# EAGLE board HandCream2040 (EAGLE 9.6.2)
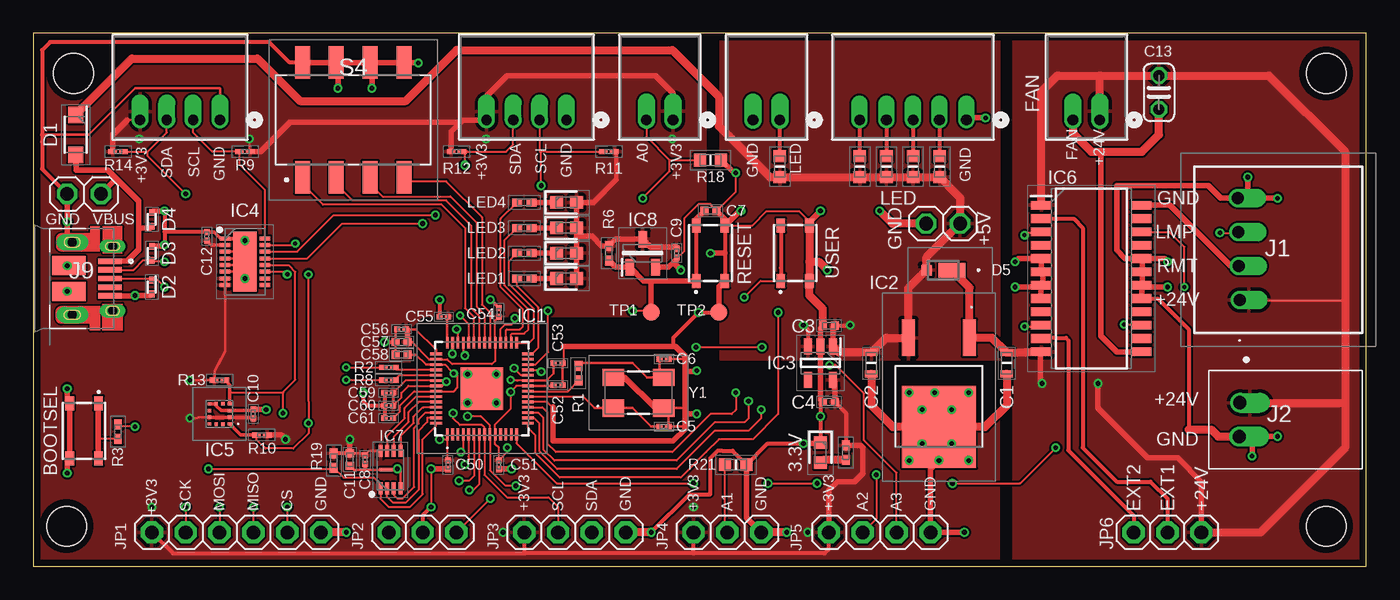
[diagram p1: board, top side]
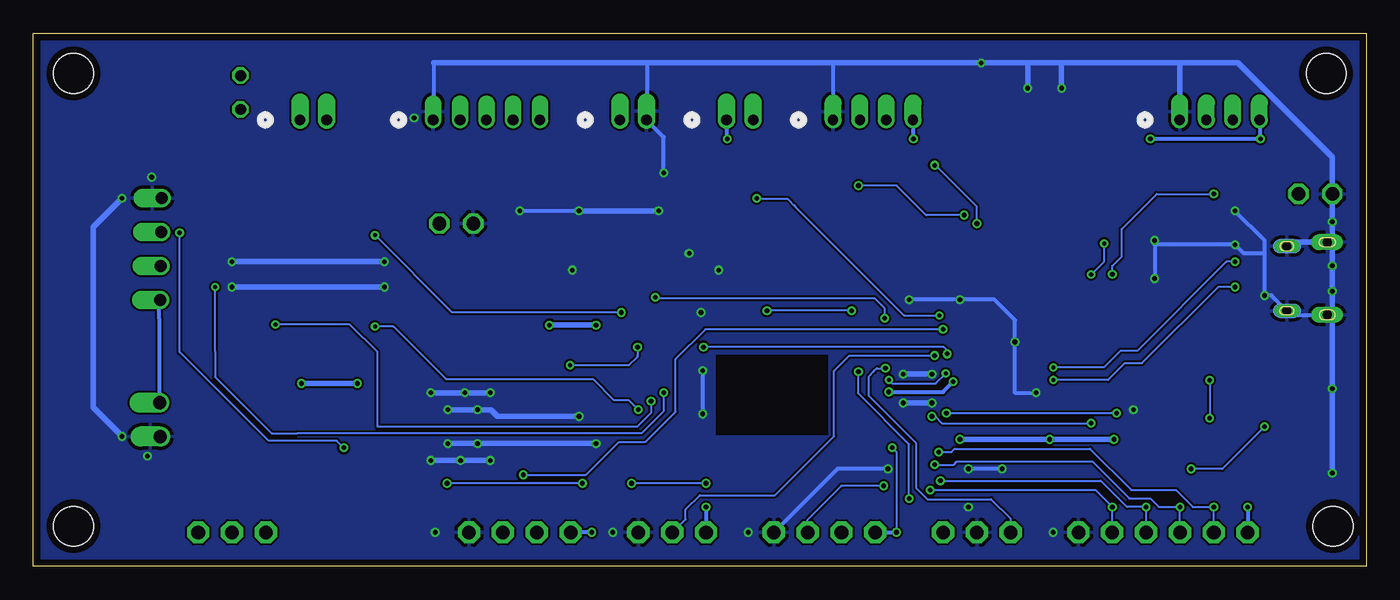
[diagram p2: board, bottom side, seen from below]

Size 100 x 40 mm. Coordinates in mm from the lower left corner, seen from the top.
Outline: 0,0 100,0 100,40 0,40 0,0
Copper layers (1*16): Top 0.035mm / dielectric 1.6mm / Bottom 0.035mm
Design rules "Elecrow_2-layer_PCB_eagle_rule": minimum track width 6mil, minimum drill 12mil, track to track 6mil, track to pad 6mil, pad to pad 6mil, via to via 8mil, smd to smd 0mil, copper to edge 20mil, drill to drill 10mil, minimum pad ring 6mil, minimum via ring 6mil, stop-mask expansion 0mil, vias tented up to drill 100mil, thermal gap 10mil
Net classes: 1 power: width 0.152 mm, drill 0.152 mm, clearance 0.152 mm; 2 gnd: width 0.152 mm, drill 0.152 mm, clearance 0.152 mm; 3 usbvcc: width 0.152 mm, drill 0.152 mm, clearance 0.152 mm
Holes 3 mm at 3,37 97,37 97,3 2.5,3
bRestrict: area 40.4,9.8 to 48.8,15.9

## Footprints (pad centres in the part's own frame; a part is rotated, then mirrored left to right if it is on the bottom)
CAPC1608X90N = smd 0.54 x 0.94: 1 -0.8,0; 2 0.8,0
CAPC1608X80N = smd 0.54 x 0.94: 1 -0.8,0; 2 0.8,0
CAPC1005X55N = smd 0.6 x 0.62: 1 -0.46,0; 2 0.46,0
CAPC0603X33N = smd 0.46 x 0.42: 1 -0.33,0; 2 0.33,0
C025-024X044 = drill 0.813 octagon: 1 -1.27,0; 2 1.27,0
SODFL3616X98N = smd 1.24 x 1.12: 1 -1.5,0; 2 1.5,0
SODFL1006X45N = smd 0.5 x 0.42: 1 -0.525,0; 2 0.525,0
VS1EQH01HM3H = smd 2 x 1.1: 1 -0.65,0 | smd 0.8 x 0.8: 2 1.25,0
SC091413 = smd 0.875 x 0.2: 1 -3.438,2.6; 2 -3.438,2.2; 3 -3.438,1.8; 4 -3.438,1.4; 5 -3.438,1; 6 -3.438,0.6; 7 -3.438,0.2; 8 -3.438,-0.2; 9 -3.438,-0.6; 10 -3.438,-1; 11 -3.438,-1.4; 12 -3.438,-1.8; 13 -3.438,-2.2; 14 -3.438,-2.6; 29 3.438,-2.6; 30 3.438,-2.2; 31 3.438,-1.8; 32 3.438,-1.4; 33 3.438,-1; 34 3.438,-0.6; 35 3.438,-0.2; 36 3.438,0.2; 37 3.438,0.6; 38 3.438,1; 39 3.438,1.4; 40 3.438,1.8; 41 3.438,2.2; 42 3.438,2.6 | smd 0.2 x 0.875: 15 -2.6,-3.438; 16 -2.2,-3.438; 17 -1.8,-3.438; 18 -1.4,-3.438; 19 -1,-3.438; 20 -0.6,-3.438; 21 -0.2,-3.438; 22 0.2,-3.438; 23 0.6,-3.438; 24 1,-3.438; 25 1.4,-3.438; 26 1.8,-3.438; 27 2.2,-3.438; 28 2.6,-3.438; 43 2.6,3.438; 44 2.2,3.438; 45 1.8,3.438; 46 1.4,3.438; 47 1,3.438; 48 0.6,3.438; 49 0.2,3.438; 50 -0.2,3.438; 51 -0.6,3.438; 52 -1,3.438; 53 -1.4,3.438; 54 -1.8,3.438; 55 -2.2,3.438; 56 -2.6,3.438 | smd 3.2 x 3.2: 57 0,0
TPS7A6533QKVURQ1 = smd 2.75 x 1: 1 0,2.29; 3 0,-2.29 | smd 6.15 x 5.55: 2 6.7,0
SOT95P280X145-5N = smd 1.2 x 0.6: 1 -1.25,0.95; 2 -1.25,0; 3 -1.25,-0.95; 4 1.25,-0.95; 5 1.25,0.95
SON50P300X500X80-17N = smd 0.8 x 0.3: 1 -1.5,1.75; 2 -1.5,1.25; 3 -1.5,0.75; 4 -1.5,0.25; 5 -1.5,-0.25; 6 -1.5,-0.75; 7 -1.5,-1.25; 8 -1.5,-1.75; 9 1.5,-1.75; 10 1.5,-1.25; 11 1.5,-0.75; 12 1.5,-0.25; 13 1.5,0.25; 14 1.5,0.75; 15 1.5,1.25; 16 1.5,1.75 | smd 1.75 x 4.5: 17 0,0
MC3479 = smd 0.275 x 0.25: 1 -0.762,0.75; 2 -0.762,0.25; 3 -0.762,-0.25; 4 -0.762,-0.75; 7 0.763,-0.75; 8 0.763,-0.25; 9 0.763,0.25; 10 0.763,0.75 | smd 0.25 x 0.275: 5 -0.25,-0.763; 6 0.25,-0.763; 11 0.25,0.762; 12 -0.25,0.762
SOP100P800X190-24N = smd 1.525 x 0.65: 1 -3.762,5.5; 2 -3.762,4.5; 3 -3.762,3.5; 4 -3.762,2.5; 5 -3.762,1.5; 6 -3.762,0.5; 7 -3.762,-0.5; 8 -3.762,-1.5; 9 -3.762,-2.5; 10 -3.762,-3.5; 11 -3.762,-4.5; 12 -3.762,-5.5; 13 3.762,-5.5; 14 3.762,-4.5; 15 3.762,-3.5; 16 3.762,-2.5; 17 3.762,-1.5; 18 3.762,-0.5; 19 3.762,0.5; 20 3.762,1.5; 21 3.762,2.5; 22 3.762,3.5; 23 3.762,4.5; 24 3.762,5.5
SON50P300X200X60-9N = smd 0.9 x 0.3: 1 -1.4,0.75; 2 -1.4,0.25; 3 -1.4,-0.25; 4 -1.4,-0.75; 5 1.4,-0.75; 6 1.4,-0.25; 7 1.4,0.25; 8 1.4,0.75 | smd 0.25 x 1.65: 9 0,0
SOT96P237X112-3N = smd 1.25 x 0.65: 1 -1.05,0.96; 2 -1.05,-0.96; 3 1.05,0
S04BXASS1NBNLFSN = drill 0.9 pad 1.4 offset: 1 0,0; 2 2.54,0.04; 3 5.08,0.08; 4 7.62,0.12
JST_S2B-XH-A(LF)(SN) = drill 1 offset: 1 -1.27,0.02; 2 1.27,-0.02
CONN_S4B-PH-K-S_JST = drill 0.762 pad 1.27 offset: 1 0,0; 2 2.007,0; 3 3.988,0; 4 5.994,0
CONN_S2B-PH-K-S_JST = drill 0.813 pad 1.321 offset: 1 0,0; 2 2.007,0
CONN_S5B-PH-K-S_JST = drill 0.813 offset: 1 0,0; 2 2.007,0; 3 3.988,0; 4 5.994,0; 5 8.001,0
AMPHENOL_10103594-0001LF = smd 0.4 x 1.75: 1 -1.3,2.825; 2 -0.65,2.825; 3 0,2.825; 4 0.65,2.825; 5 1.3,2.825 | drill 0.65 pad 0.73 long: 6 -2.425,3.03; 7 2.425,3.03 | drill 0.7 pad 1.2 long: 8 -2.725,0; 9 2.725,0 | smd 1.05 x 2.1 bottom: 10 -2.425,3.03; 11 2.425,3.03 | smd 1.425 x 2.5: S1 -0.963,-0.25; S2 0.963,-0.25
1X06 = drill 1.016 pad 1.676 octagon: 1 -6.35,0; 2 -3.81,0; 3 -1.27,0; 4 1.27,0; 5 3.81,0; 6 6.35,0
1X03 = drill 1.016 pad 1.676 octagon: 1 -2.54,0; 2 0,0; 3 2.54,0
1X04 = drill 1.016 pad 1.676 octagon: 1 -3.81,0; 2 -1.27,0; 3 1.27,0; 4 3.81,0
1X02 = drill 1.016 octagon: 1 -1.27,0; 2 1.27,0
LEDC1608X80N = smd 0.95 x 0.95: 1 -0.75,0; 2 0.75,0
RESC1005X35N = smd 0.75 x 0.6: 1 -0.55,0; 2 0.55,0
RESC0603X28N = smd 0.625 x 0.4: 1 -0.412,0; 2 0.412,0
RESC1608X55N = smd 0.9 x 0.95: 1 -0.8,0; 2 0.8,0
RESC1005X40N = smd 0.75 x 0.6: 1 -0.55,0; 2 0.55,0
SMT(4.2X3.2) = smd 1.05 x 0.65: 1 -2.075,1.075; 2 2.075,1.075; 3 -2.075,-1.075; 4 2.075,-1.075
2194MST = smd 1.13 x 2.44: 1 -3.81,-4.3; 2 -1.27,-4.3; 3 1.27,-4.3; 4 3.81,-4.3; 5 3.81,4.3; 6 1.27,4.3; 7 -1.27,4.3; 8 -3.81,4.3
B1,27 = smd 1.27 x 1.27: TP 0,0
ABM3BAIG = smd 1.6 x 1.3: 1 -1.9,-1.15; 2 1.9,-1.15; 3 1.9,1.15; 4 -1.9,1.15

## Placement (x,y rotation side)
C1  CGA3E3X5R1H334K080AB  [CAPC1608X90N]  73.03,15.24 90 top
C2  C1608X5R1H104K080AA  [CAPC1608X80N]  62.87,15.24 90 top
C3  GRM155R61E105KE11J  [CAPC1005X55N]  59.69,18.05 0 top
C4  GRM155R61E105KE11J  [CAPC1005X55N]  59.69,12.34 0 top
C5  GRM0335C1E150FA01D  [CAPC0603X33N]  47.31,10.48 0 top
C6  GRM0335C1E150FA01D  [CAPC0603X33N]  47.31,15.56 0 top
C7  GRM155R61E105KE11J  [CAPC1005X55N]  50.8,26.67 180 top
C8  GRM033R60J104KE19D  [CAPC0603X33N]  24.89,8 90 top
C9  GRM033R60J104KE19D  [CAPC0603X33N]  48.26,23.5 90 top
C10  GRM033R60J104KE19D  [CAPC0603X33N]  16.51,11.43 270 top
C11  GRM155R61A225KE01J  [CAPC1005X55N]  23.75,8 90 top
C12  GRM033R60J104KE19D  [CAPC0603X33N]  13.02,24.77 270 top
C13  [C025-024X044]  84.45,35.56 90 top
C50  GRM033R60J104KE19D  [CAPC0603X33N]  31.11,7.62 90 top
C51  GRM033R60J104KE19D  [CAPC0603X33N]  34.92,7.62 90 top
C52  GRM033R60J104KE19D  [CAPC0603X33N]  39.37,13.59 180 top
C53  GRM033R60J104KE19D  [CAPC0603X33N]  39.37,15.24 180 top
C54  GRM033R60J104KE19D  [CAPC0603X33N]  34.92,19.05 270 top
C55  GRM033R60J104KE19D  [CAPC0603X33N]  30.8,18.73 0 top
C56  GRM033R60J104KE19D  [CAPC0603X33N]  27.62,17.78 0 top
C57  GRM155R61A225KE01J  [CAPC1005X55N]  27.62,16.83 0 top
C58  GRM155R61A225KE01J  [CAPC1005X55N]  27.62,15.88 0 top
C59  GRM033R60J104KE19D  [CAPC0603X33N]  26.67,13.02 0 top
C60  GRM033R60J104KE19D  [CAPC0603X33N]  26.67,12.06 0 top
C61  GRM033R60J104KE19D  [CAPC0603X33N]  26.67,11.11 0 top
D1  MBR120VLSFT1G  [SODFL3616X98N]  3.17,32.38 270 top
D2  DF2S6.8FS,L3M  [SODFL1006X45N]  8.89,20.95 270 top
D3  DF2S6.8FS,L3M  [SODFL1006X45N]  8.89,23.5 90 top
D4  DF2S6.8FS,L3M  [SODFL1006X45N]  8.89,26.04 90 top
D5  VS-1EQH01HM3_H  [VS1EQH01HM3H]  68.26,22.23 180 top
IC1  SC0914_13_  [SC091413]  33.66,13.34 90 top
IC2  UA78M05CKVURG3  [TPS7A6533QKVURQ1]  67.94,17.14 270 top
IC3  MIC5504-3.3YM5-TR  [SOT95P280X145-5N]  59.05,15.24 270 top
IC4  LTC4317CDHC#PBF  [SON50P300X500X80-17N]  15.88,22.86 0 top
IC5  MC3479  [MC3479]  13.97,11.43 180 top
IC6  TBD62064AFAG,EL  [SOP100P800X190-24N]  79.38,21.59 0 top
IC7  W25Q16JVUXIQ_TR  [SON50P300X200X60-9N]  26.8,7.24 90 top
IC8  MCP111T-315E_TT  [SOT96P237X112-3N]  45.72,23.5 90 top
J1  S04B-XASS-1N-BN_LF__SN_  [S04BXASS1NBNLFSN]  90.5,20 90 top
J2  S2B-XH-A(LF)(SN)  [JST_S2B-XH-A(LF)(SN)]  90.5,11 270 top
J3  S4B-PH-K-S(LF)(SN)  [CONN_S4B-PH-K-S_JST]  14,33.5 180 top
J4  S4B-PH-K-S(LF)(SN)  [CONN_S4B-PH-K-S_JST]  40,33.5 180 top
J5  S2B-PH-K-S(LF)(SN)  [CONN_S2B-PH-K-S_JST]  48,33.5 180 top
J6  S2B-PH-K-S(LF)(SN)  [CONN_S2B-PH-K-S_JST]  56,33.5 180 top
J7  S5B-PH-K-S_(LF)(SN)  [CONN_S5B-PH-K-S_JST]  70,33.5 180 top
J8  S2B-PH-K-S(LF)(SN)  [CONN_S2B-PH-K-S_JST]  80,33.5 180 top
J9  10103594-0001LF  [AMPHENOL_10103594-0001LF]  2.92,21.59 270 top
JP1  [1X06]  15.24,2.54 0 top
JP2  [1X03]  29.21,2.54 0 top
JP3  [1X04]  40.64,2.54 0 top
JP4  [1X03]  52.07,2.54 0 top
JP5  [1X04]  63.5,2.54 0 top
JP6  [1X03]  85.09,2.54 180 top
JP7  [1X02]  3.81,27.94 180 top
JP8  [1X02]  68.26,25.72 180 top
LED1  150060VS75000  [LEDC1608X80N]  40.01,21.59 0 top
LED2  150060VS75000  [LEDC1608X80N]  40.01,23.5 0 top
LED3  150060VS75000  [LEDC1608X80N]  40.01,25.4 0 top
LED4  150060VS75000  [LEDC1608X80N]  40.01,27.3 0 top
LED5  150060VS75000  [LEDC1608X80N]  59.05,8.53 270 top
R1  CRCW04021K00FKEDC  [RESC1005X35N]  40.89,14.48 270 top
R2  CRCW020127R0FNED  [RESC0603X28N]  26.67,14.92 0 top
R3  CRCW04021K00FKEDC  [RESC1005X35N]  6.35,10.1 270 top
R4  CRCW060310K0FKECC  [RESC1608X55N]  62,30 90 top
R5  CRCW0402620RFKED  [RESC1005X40N]  60.96,8.53 90 top
R6  CRCW040210K0FKEDC  [RESC1005X35N]  43.18,23.5 90 top
R7  CRCW060310K0FKECC  [RESC1608X55N]  64,30 90 top
R8  CRCW020127R0FNED  [RESC0603X28N]  26.67,13.97 0 top
R9  CRCW02014K70FNED  [RESC0603X28N]  15.88,31.11 0 top
R10  CRCW02014K70FNED  [RESC0603X28N]  17.14,9.84 0 top
R11  CRCW02014K70FNED  [RESC0603X28N]  43.18,31.11 0 top
R12  CRCW02014K70FNED  [RESC0603X28N]  31.75,31.11 180 top
R13  CRCW02014K70FNED  [RESC0603X28N]  13.97,13.97 180 top
R14  CRCW02014K70FNED  [RESC0603X28N]  6.35,31.11 180 top
R15  CRCW060310K0FKECC  [RESC1608X55N]  66,30 90 top
R16  CRCW060310K0FKECC  [RESC1608X55N]  68,30 90 top
R17  CRCW060310K0FKECC  [RESC1608X55N]  56,30 90 top
R18  CRCW060310K0FKECC  [RESC1608X55N]  50.8,30.48 0 top
R19  CRCW040210K0FKEDC  [RESC1005X35N]  22.54,7.94 90 top
R21  CRCW060310K0FKECC  [RESC1608X55N]  52.7,7.62 0 top
R22  CRCW0402620RFKED  [RESC1005X40N]  36.83,27.3 180 top
R23  CRCW0402620RFKED  [RESC1005X40N]  36.83,25.4 180 top
R24  CRCW0402620RFKED  [RESC1005X40N]  36.83,23.5 180 top
R25  CRCW0402620RFKED  [RESC1005X40N]  36.83,21.59 180 top
S1  SKRPACE010  [SMT(4.2X3.2)]  3.81,10.16 270 top
S2  SKRPACE010  [SMT(4.2X3.2)]  50.8,23.5 90 top
S3  SKRPACE010  [SMT(4.2X3.2)]  57.15,23.5 90 top
S4  219-4MST  [2194MST]  24,33.5 0 top
TP1  TPB1,27  [B1,27]  46.35,19.05 0 top
TP2  TPB1,27  [B1,27]  51.44,19.05 0 top
Y1  ABM3BAIG-12.000MHZ-12-4-T  [ABM3BAIG]  45.4,13.02 0 top

## Tracks (layer width: path | path; a pad name or v marks a point on that pad's centre or on a via)
+1V1  (via drill 0.3)
  Top 0.152: C61.2 27.46,11.58 27.46,12.02 28.58,13.13 IC1.50 31.55,13.13 31.83,13.41 31.83,14.35 31.57,14.61 31.42,14.61 | IC1.45 30.89,15.13 31.39,14.63 | 31.39,14.63 31.42,14.61 | IC1.23 36.36,13.94 36.27,13.94 35.85,13.94 v35.82,13.97 35.81,14.02 v35.81,13.97 | 38.57,14.01 38.56,14.02 38.53,13.94 | v31.55,14.48 31.39,14.48 31.39,14.63 | 31.39,14.63 31.42,14.61
  Top 0.203: IC1.45 29.46,15.13 28.72,15.88 C58.2 | IC1.23 38.53,13.94 | C53.2 39.04,14.48 38.57,14.01
  Bottom 0.152: v35.81,13.97 35.56,13.72 32.31,13.72 v31.55,14.48
+3V3  (via drill 0.35)
  Top 0.152: J3.4 7.05,33.5 | C51.2 34.87,7.95 | 28.05,17.78 C56.2 | IC1.1 31.05,9.53 | 31.05,9.53 31.05,8.01 C50.2 | IC1.49 28.14,13.54 27.62,13.02 27.62,12.69 C60.2 C59.2 27.92,13.94 IC1.48 | 31.05,18.66 C55.2 | R11.2 43.73,30.98 | 32.24,33.5 32.08,33.34 | JP3.1 36.83,0.95 | R9.2 16.19,31.11 v16.19,32.07 | C51.2 34.92,8.89 34.66,9.16 IC1.10 34.66,10.65 35.81,11.81 v35.81,13.08 36.25,13.52 36.25,13.54 IC1.22 | C54.2 34.66,18.45 IC1.33 34.66,15.4 34.42,15.16 31.42,15.16 31.05,15.54 IC1.44 | v11.75,13.97 R13.2 | 13.97,11.18 12.38,11.18 12.31,11.11 v11.75,11.11 | 38.99,13.54 C52.2 | v30.48,9.53 31.05,9.53 | C11.2 23.72,8.49 | C51.2 35.56,8.59 v35.56,8.89
  Top 0.203: IC1.44 29.69,15.54 28.4,16.83 C57.2 | IC1.43 30.22,16.25 28.69,17.78 28.05,17.78 | IC1.22 38.64,13.54 38.99,13.54 | C11.2 24.76,8.46 C8.2 25.2,8.64 IC7.8 | IC1.42 31.05,18.66 | 13.59,14.03 13.59,14.65 14.38,16.11 IC4.8 | IC1.48 30.9,13.94 v30.99,13.84 30.68,13.54 IC1.49
  Top 0.254: C10.2 16.43,11.18 IC5.2 13.97,11.18 13.72,11.18 IC5.9 | IC4.2 13.34,24.11 C12.2
  Top 0.305: 43.73,30.98 43.73,29.01 | C4.2 60.96,11.53 R5.2 | JP1.1 10.48,0.95 36.83,0.95 | 49.53,0.95 36.83,0.95 | 49.53,0.95 JP4.1 | 49.53,0.95 59.37,0.95 59.69,1.27 JP5.1 | JP3.1 36.83,0.95 | IC4.7 IC4.8 | 23.72,8.49 R19.2
  Top 0.406: 48.26,23.95 46.31,23.95 IC8.3 43.68,24.55 R6.2 42.63,24.05 41.91,24.77 40.76,24.77 | J5.1 48,35.52 46.69,36.83 43.56,36.83 35.56,36.83 34.01,35.28 J4.4 32.24,33.5 31.34,32.6 R12.2 | 43.73,29.01 42.02,27.3 LED4.2 LED3.2 LED2.2 LED1.2 | C4.2 60.15,13.85 IC3.5 | 7.05,33.5 5.94,32.38 R14.2 | R5.2 62.05,9.07 62.23,8.89 62.23,6.99 61.59,6.35 60.33,6.35 59.69,5.71 JP5.1 | R9.2 17.05,31.11 19.27,33.34 32.08,33.34 | C56.2 28.08,17.65 C57.2 | v23.75,9.53 C11.2 | R10.2 18.61,9.84 v18.92,9.53
  Bottom 0.152: v35.56,8.89 35.24,8.57 v35.24,2.54 | v11.75,13.97 v11.75,11.11
  Bottom 0.305: v47.94,32.07 47.94,33.44 | v33.97,32.07 33.97,33.47 | 7.94,33.43 v7.94,32.07 v16.19,32.07 | JP3.1 v35.24,2.54 | v8.89,4.45 JP1.1 | v49.53,4.45 JP4.1 | v58.1,2.54 JP5.1 | v35.81,13.08 31.75,13.08 v30.99,13.84
  Bottom 0.406: v30.48,9.53 v23.75,9.53 v18.92,9.53
  pour Top: 0.5,39.5 0.5,0.5 72.5,0.5 72.5,14.5 50.5,14.5 50.5,18.5 39.5,18.5 39.5,8.13 27.32,8.13 27.32,15.32 28.32,15.32 28.32,17.84 29.21,18.73 50.5,18.75 50.5,39.5
+5V  (via drill 0.35)
  Top 0.305: v57.78,18.1 58.1,17.78 IC3.3 | 61.23,18.05 C3.2
  Top 0.406: IC3.1 60.01,17.91 C3.2
  Top 0.61: IC3.1 60.45,16.04 C2.2 63.97,17.14 IC2.3 65.66,20.87 D5.2 67.01,23.2 JP8.1 69.53,27.67 69.22,27.98 R16.1 R15.1 R7.1 63.25,29.2 R4.1 R17.1 55.26,29.2 51.44,33.02 51.44,35.24 47.94,38.73 31.75,38.73 27.94,34.92 20,34.92 16.83,38.1 7.39,38.1 D1.1
  Bottom 0.406: v57.78,18.1 v61.28,18.1
  pour Top: 51.5,39.5 51.5,15.5 72.5,15.5 72.5,39.5
+24V  (via drill 0.35)
  Top 0.152: 90.56,19.94 98.42,19.94
  Top 0.406: JP6.1 87.63,6.35 85.85,8.13 83.63,8.13 79.88,11.87 v79.88,13.72 | v75.69,13.72 75.56,13.85 75.56,16.04
  Top 0.61: JP6.1 92.08,2.54 98.42,8.89 98.42,12.32 | 83.33,36.83 C13.2 | C13.2 92.71,36.83 98.42,31.11 98.42,19.94 98.42,12.32 | IC6.1 75.61,35.61 76.83,36.83 80.01,36.83 C13.2 | J8.1 80,36.82 | 75.56,16.04 74.37,16.04 C1.2 71.92,17.14 IC2.1 70.23,20.9 D5.1 | J2.1 98.38,12.27 98.42,12.32 | J1.1 90.56,19.94
  Bottom 0.305: 90.55,19.95 90.55,18.54 90.55,13.59 90.55,12.3 J2.1
  Bottom 0.406: v75.69,13.72 v79.88,13.72
  pour Top: 99.5,39.5 99.5,0.5 73.5,0.5 73.5,39.5
A0  (via drill 0.3, 0.35)
  Top 0.152: 47.74,30.48 45.99,32.23 J5.2 | 47.74,30.48 R18.1 | v45.72,27.62 47.74,29.65 47.74,30.48 | IC1.38 32.66,18.19 v32.02,18.83
  Bottom 0.152: 42.98,27.13 42.82,26.98 | 42.82,26.98 43.43,27.58 45.72,27.58 v45.72,27.62 | v32.02,18.83 34.68,18.83 35.15,19.3 42.82,26.98
A1  (via drill 0.35)
  Top 0.152: JP4.2 51.91,2.71 51.91,3.66 R21.1 | IC1.39 32.26,15.94 v32.38,15.81
  Bottom 0.152: v32.38,15.81 38.14,15.81 38.77,15.81 39.93,14.66 39.93,9.75 44.35,5.33 49.99,5.33 51.05,4.27 51.05,3.5 51.97,2.59 JP4.2
A2  (via drill 0.35)
  Top 0.152: IC1.40 31.86,17.68 v31.75,17.78 | v63.25,6.86 63.25,3.56 JP5.2
  Bottom 0.152: v31.75,17.78 49.58,17.78 51.82,15.54 51.82,11.58 54.1,9.3 56.08,9.3 58.52,6.86 v63.25,6.86
A3  (via drill 0.3, 0.35)
  Top 0.152: v49.72,16.45 v54.67,16.45 | IC1.41 31.45,15.96 v31.43,15.94 | v59.74,15.09 60.2,15.09 62.33,12.95 62.33,9.45 64.77,7.01 JP5.3
  Bottom 0.152: v54.67,16.45 54.67,15.85 54.67,15.71 55.3,15.09 v59.74,15.09 | v49.72,16.45 31.69,16.45 31.43,16.18 31.43,15.95 v31.43,15.94
BOOTSEL
  Top 0.152: R3.2 5.03,9.55 5.03,9.6 4.88,9.53
  Top 0.406: S1.1 4.88,9.53 S1.2
BUTN1  (via drill 0.35)
  Top 0.152: v36.13,18.61 36.02,18.49 36.02,18.29 35.85,18.12 35.37,18.12 35.05,17.8 IC1.32 | v53.34,20.19 54.57,21.42 55.84,21.42 S3.1
  Top 0.305: S3.2 56.08,22.4 S3.1
  Bottom 0.152: v36.13,18.61 36.13,19.37 36.88,20.12 53.02,20.12 53.26,20.12 v53.33,20.19 v53.34,20.19
CS  (via drill 0.35)
  Top 0.152: v19.05,4.45 JP1.5 | IC1.7 33.45,6.15 33.02,5.71 v32.7,5.71
  Bottom 0.152: JP1.5 v19.05,4.45 20.32,5.71 v32.7,5.71
DIPSW1
  Top 0.152: IC1.34 34.26,19.05 33.66,19.64 33.66,26.2 30.98,28.88 28.19,28.88 28.19,28.96 28.04,29.11 27.89,29.11 S4.4
DIPSW2
  Top 0.152: 25.3,28.65 26.2,27.75 31.3,27.75 33.26,25.8 33.26,19.49 33.85,18.89 IC1.35 | 25.3,28.65 25.3,29.11 S4.3 | 25.3,28.65
DIPSW3
  Top 0.152: IC1.36 33.45,18.77 32.86,19.37 32.86,25.56 30.97,27.45 23.96,27.45 22.73,28.68 22.71,28.65 22.71,29.11 S4.2
DIPSW4
  Top 0.152: S4.1 20.27,29.11 20.27,28.65 20.24,28.63 21.73,27.14 30.64,27.14 32.38,25.4 32.38,19.37 33.05,18.7 IC1.37
DRV1  (via drill 0.3, 0.35)
  Top 0.152: IC1.15 37.09,10.42 37.64,9.87 37.64,8.52 39.5,6.67 48.58,6.67 50.48,8.57 51.44,9.53 53.98,9.53 55.88,11.43 v55.88,19.05 | v74.37,24.84 74.52,24.99 75.59,24.99 IC6.3
  Bottom 0.152: v74.37,24.84 68.58,19.05 v55.88,19.05
DRV2  (via drill 0.3, 0.35)
  Top 0.152: IC1.16 37.55,11.13 37.95,10.74 37.95,8.65 39.29,7.3 48.26,7.3 51.12,10.16 53.66,10.16 54.61,11.11 v54.61,11.75 | v74.37,17.98 75.59,17.98 IC6.10
  Bottom 0.152: v74.37,17.98 72.97,17.98 69.04,14.05 58.01,14.05 56.43,12.46 55.32,12.46 v54.61,11.75
DRV3  (via drill 0.3, 0.35)
  Top 0.152: IC1.17 37.87,11.54 38.25,11.15 38.25,8.78 39.09,7.94 48.26,7.94 51.12,10.79 53.34,10.79 53.66,11.11 v53.66,12.38 | v81.84,18.14 83.06,18.14 IC6.15
  Bottom 0.152: v53.66,12.38 53.66,11.49 54.67,10.48 74.18,10.48 74.18,16.07 76.25,18.14 v81.84,18.14
DRV4  (via drill 0.3, 0.35)
  Top 0.152: IC1.18 38.19,11.94 38.56,11.57 38.56,9.22 39.2,8.57 47.94,8.57 50.8,11.43 52.39,11.43 52.7,11.75 v52.7,13.02 | IC6.22 85.23,25.09 86.36,23.96 v86.36,20.95
  Bottom 0.152: v52.7,13.02 52.7,11.62 54.36,9.97 80.2,9.97 82.11,9.97 86.36,14.22 86.36,16.13 v86.36,20.95
EXT1
  Top 0.305: IC6.2 78.05,26.09 78.74,25.4 78.74,8.89 81.28,6.35 83.82,6.35 85.09,5.08 JP6.2
EXT2
  Top 0.305: JP6.3 82.55,3.8 77.65,8.7 77.65,16.97 77.47,17.14 76.63,17.14 75.67,17.14 IC6.11
FAN
  Top 0.406: IC6.13 81.28,16.09 80.09,17.28 80.09,30.56 80.09,31.11 80.64,31.11
  Top 0.61: J8.2 77.99,32.5 79.38,31.11 80.64,31.11 83.19,31.11 84.45,32.38 C13.1
GND  (via drill 0.35)
  Top 0.152: S2.4 53.95,25.57 55.02,26.64 57.45,26.64 58.23,25.86 | v29.84,4.45 v29.84,7.3 29.87,7.32 29.87,7.29 | 50.86,27.08 50.73,27.21 49.95,27.21 48.85,26.12 48.85,23.66 48.56,23.37 | 50.86,27.08 50.87,27.07 | v52.7,29.53 52.7,28.11 C7.1 50.87,27.06 50.9,27.13 50.86,27.08 | 27.55,7.24 26.99,7.24 | 34.75,12.34 | 83.21,22.1 IC6.19 | 24.89,7.32 24.99,7.32 24.99,7.24 | 13.71,12.18 IC5.6 | 17.37,11.76 17.37,11.73 v17.46,11.75 | 30.48,18.75 C55.1 | C9.1 48.31,23.16 48.26,23.04 | 75.59,20.88 75.48,20.95 | 75.74,21.95 IC6.6 | IC7.9 27.28,7.32 v27.3,7.3 | 35.81,7.29 35.81,7.32 v35.88,7.3 | IC1.19 37.19,12.34 38.56,12.34 38.86,12.04 38.99,11.94 | 39.78,16.51 39.78,15.24 C53.1 | IC6.8 75.74,20.12 75.59,20.12 | 75.74,21.18 IC6.7 | 83.19,21.04 83.21,21.18 IC6.18 | 7.59,20.29 7.62,20.27 v7.62,20.32 | J9.S2 2.59,20.73 v2.54,20.64 | J9.S1 2.59,22.55 v2.54,22.54 | 34.75,12.34 IC1.57 | 34.75,12.34 v34.73,12.26 | v15.88,21.59 15.85,21.64 15.85,22.73 15.85,22.86 IC4.17 | 0.76,32.38 0.76,32.46 0.66,32.38 | IC2.2 68.9,10.45 | IC2.2 69.85,10.45 | IC2.2 67.31,10.45 | IC2.2 68.9,9.49 v68.9,9.21
  Top 0.203: C53.1 C52.1 | 27.43,7.24 26.99,7.24 IC7.9 24.99,7.24 | C11.1 24.05,7.24 24.77,7.24 24.99,7.24 | C56.1 27.16,17.65 C57.1 C58.1 | 0.67,32.38 0.76,32.38 4.16,32.38 7.66,35.88 13.97,35.88 | 34.75,12.34 34.66,12.34 | 24.99,7.24 24.97,7.24 | IC7.4 27.55,7.24 | 14,35.85 J3.1 | IC4.3 15.1,23.61 15.6,23.11 | 15.6,23.11 15.85,22.86 15.6,22.61 IC4.5 | IC4.4 15.6,23.11 | IC4.6 15.23,22.11 15.85,22.73 | C6.2 48.9,15.56 | 48.9,10.48 C5.2 47.64,11.53 Y1.2 48.77,11.87 48.9,11.75
  Top 0.254: C54.1 34.3,20 v34.29,20 | C10.1 16.43,11.68 15.24,11.68 IC5.3 14.07,11.68 13.72,12.04 IC5.6 | 13.71,12.18 IC5.7 | C12.1 13.57,25.09 14.06,24.61 IC4.1 | 48.16,16.51 48.01,16.51
  Top 0.305: S2.4 51.88,23.5 S2.3 | IC6.17 83.19,20.09 84.37,20.09 86.68,17.78 86.68,10.26 | S4.8 19.24,37.8 17.7,39.34 1.26,39.34 0.66,38.73 0.66,32.38 0.66,31.85 0.66,29.82 JP7.2 | C8.1 24.89,7.32 24.89,7.24 | v29.84,4.45 29.21,3.81 JP2.2 | 67.51,2.54 67.42,2.62 | IC4.1 15.71,24.61 | v26.35,16.83 C57.1 | C4.1 59.05,12.16 LED5.1 | R21.2 55.09,9.21 v57.78,9.21 | v9.84,26.67 9.84,25.08 | 9.84,25.08 v9.84,24.13 | 13.01,25.08 11.68,25.08 9.84,25.08 | R21.2 52.46,8.67 51.67,8.67 51.35,8.67 50.8,8.12 50.8,6.99 50.8,5.4 49.21,5.4 v46.35,2.54 | v30.48,20 30.48,18.75 | 30.48,18.75 | 58.23,25.84 58.23,22.86 | TP2.TP v49.91,19.05 48.01,17.14 48.01,16.51 | C59.1 C60.1 | v24.77,13.02 24.77,12.39 24.75,12.38 25.07,12.06 C60.1 | C60.1 C61.1
  Top 0.406: J1.4 89.11,27.62 88.16,28.57 81.28,28.57 81.28,23.72 81.91,23.09 IC6.20 84.86,23.09 v85.09,22.86 | C7.1 51.88,26.05 S2.4 52.98,26.67 | 48.26,23.04 48.01,22.79 | 48.01,22.79 47.67,22.45 IC8.2 | S2.3 51.44,20.98 TP2.TP | JP4.3 53.51,3.65 R21.2 | S4.8 S4.7 | S4.7 S4.6 | S4.6 S4.5 | C4.1 59.05,12.51 IC3.2 59.05,17.88 C3.1 | 48.01,16.51 39.78,16.51 | 38.99,11.94 38.99,9.4 48.01,9.4 48.9,10.29 48.9,10.48 48.9,11.43 | 91.12,27.62 90.81,27.62 91.12,27.62 | v91.44,8.26 91.44,9.75 v93.34,9.75 | J2.2 91.42,9.73 | 83.27,20.95 v85.09,20.95 | v73.66,22.86 73.89,23.09 IC6.5 IC6.6 | 75.48,20.95 v73.66,20.95 | v69.85,2.54 67.51,2.54 | C50.1 29.87,7.29 29.86,7.29 | 35.87,7.29 35.81,7.29 C51.1 | v28.89,37.78 27.83,37.78 | v25.4,35.88 25.4,37.67 S4.6 | v22.86,35.88 22.86,37.67 S4.7 | v71.44,33.66 70.16,33.66 J7.1 | v93.34,27.62 91.12,27.62 | v91.12,29.21 91.12,27.62 | v50.8,23.5 51.88,23.5 | v52.7,29.53 52.55,29.53 R18.2 | 15.71,24.61 v15.88,24.45 | C10.1 17.37,11.76 v17.45,11.76 | v2.54,13.34 2.54,12.43 S1.3 S1.4 2.54,7.89 v2.54,6.99 | J9.5 7.47,20.29 7.59,20.29 | v7.62,20.32 8.78,20.32 D2.2 | v9.84,24.13 9.73,24.02 D3.2 | D4.2 9,26.67 v9.84,26.67 | v48.58,22.23 48.01,22.79 | 75.59,20.88 75.59,20.12 | 75.74,21.18 75.74,21.95 | 83.21,21.18 83.21,21.95 83.21,22.1 83.21,23.01 83.21,23.02 | 83.19,21.04 83.19,20.09 | v59.05,26.67 58.23,25.84 | v57.78,9.21 58.99,9.21 LED5.1 | JP7.2 v2.54,25.84 2.54,24.7 J9.8 | JP5.4 67.31,7.3 v67.94,7.94 | Y1.4 44.37,14.17 46.67,11.87 Y1.2 | 48.9,11.43 48.9,11.75 48.9,14.61 | 48.9,14.61 48.9,15.56 48.9,15.78 48.16,16.51 | v49.78,14.67 49.72,14.61 48.9,14.61 | v49.78,11.43 48.9,11.43
  Top 0.61: 86.68,10.26 88.37,10.26 88.89,9.73 J2.2 | S3.4 58.23,22.86 | 58.23,22.86 S3.3 58.23,20.32 59.23,19.32 C3.1 | C2.1 62.87,12.06 64.48,10.45 67.31,10.45 | C1.1 73.03,12.06 71.41,10.45 69.85,10.45 68.9,10.45 IC2.2 | JP8.2 64.45,25.72 v63.5,26.67 | 58.23,22.86 58.93,22.86 v59.56,22.23 | v23.5,2.54 JP1.6 | v46.35,2.54 JP3.4 | v56.52,2.54 JP4.3
  Bottom 0.305: v52.7,29.53 52.7,32.21 J6.2 | v27.3,7.3 v29.84,7.3 | v34.29,20 v30.48,20 27.88,20 26.35,18.48 v26.35,16.83 26.35,13.02 v24.77,13.02 | v59.05,26.67 v63.5,26.67 | J9.9 5.65,18.86 J9.11 7.11,20.32 v7.62,20.32 7.62,23.5 | v49.78,14.67 v49.78,11.43 | 7.62,23.5 7.62,24.45 v9.84,26.67 | 7.62,23.5 9.21,23.5 v9.84,24.13 15.88,24.13 | v15.88,24.45 15.88,24.13 | 15.88,24.13 v15.88,21.59 | 40.01,37.78 J4.1 | 53.98,37.78 53.98,33.52 | 69.98,37.78 69.98,33.52 | v2.54,13.34 v2.54,20.64 | v35.88,7.3 39.69,7.3 JP3.4
  Bottom 0.406: v57.78,9.21 v66.67,9.21 v68.9,9.21 | J9.9 2.54,19.25 v2.54,20.64 v2.54,22.54 2.54,24.26 v2.54,25.84 JP7.2 2.54,30.7 9.62,37.78 13.97,37.78 | 2.54,18.48 v2.54,13.34 v2.54,6.99 | v73.66,20.95 v85.09,20.95 | v65.72,7.94 v67.94,7.94 v70.17,7.94 | v65.72,13.02 v67.63,13.02 v70.17,13.02 | v68.9,11.75 v66.67,11.75 65.66,11.75 65.15,11.24 v59.05,11.24 | v32.58,14.41 v34.73,14.41 | v32.58,12.26 v34.73,12.26 | v93.34,9.75 95.5,11.91 95.5,25.46 v93.34,27.62 | v73.66,22.86 v85.09,22.86 | v53.09,26.67 v59.05,26.67 | 69.98,37.78 53.98,37.78 40.01,37.78 v28.89,37.78 25.27,37.78 22.86,37.78 | 22.86,37.78 15.88,37.78 15.11,37.78 13.97,37.78 | v22.86,35.88 22.86,37.78 | v25.4,35.88 25.4,37.66 | 2.6,24.32 J9.8 5.65,24.32 J9.10 | 13.97,37.78 14,37.75 J3.1
  pour Bottom: 0.5,39.5 0.5,0.5 99.5,0.5 99.5,39.5
LAMP  (via drill 0.35)
  Top 0.152: IC1.14 36.26,9.23 39.26,6.22 v49.53,6.22 | v55.12,6.22 v58.8,6.22 | v68.96,6.22 74.04,6.22 v76.71,8.89 | v89.03,25.02 90.36,25.02 J1.3
  Bottom 0.152: v49.53,6.22 v55.12,6.22 | v58.8,6.22 v68.96,6.22 | v76.71,8.89 77.23,9.41 82.36,9.41 89.03,16.08 v89.03,25.02
LED1
  Top 0.152: R25.2 36.28,21.02 37.85,19.45 37.85,16.38 37.41,15.94 IC1.28
LED2
  Top 0.152: IC1.29 37.21,16.77 37.52,17.09 37.52,19.35 35.68,21.2 35.68,22.89 R24.2
LED3
  Top 0.152: IC1.30 35.85,17.41 35.91,17.46 36.83,17.46 37.15,17.78 37.15,19.29 37.12,19.31 37.12,19.32 35.37,21.07 35.37,24.49 R23.2
LED4
  Top 0.152: IC1.31 35.45,17.73 35.51,17.78 36.51,17.78 36.73,17.99 36.73,19.29 35.07,20.94 35.07,26.09 R22.2
LED_G
  Top 0.152: LED5.2 59.13,7.77 59.26,7.97
  Top 0.61: R5.1 59.26,7.97
MISO  (via drill 0.35)
  Top 0.152: v16.51,4.45 JP1.4 | IC1.6 33.05,6.77 32.7,6.41 v31.94,6.41
  Bottom 0.152: JP1.4 v16.51,4.45 17.95,4.45 19.91,6.41 v31.94,6.41
MOSI  (via drill 0.35)
  Top 0.152: v13.97,4.45 JP1.3 | IC1.5 32.66,8.21 32.66,7.89 v32.38,7.62
  Bottom 0.152: JP1.3 v13.97,4.45 15.56,4.45 16.19,5.08 17.78,5.08 20.56,7.86 30.71,7.86 30.95,7.62 v32.38,7.62
N$3
  Top 0.152: J7.5
  Top 0.305: R4.2 J7.5
N$5
  Top 0.152: R7.2 64.01,30.94
  Top 0.305: J7.4 64.01,30.94
N$6
  Top 0.152: R15.2 65.99,30.94 66.01,30.94
  Top 0.305: J7.3 66.01,30.94
N$7
  Top 0.152: R16.2 68.12,30.94 67.99,30.94
  Top 0.305: J7.2 67.99,30.94
N$8
  Top 0.305: R17.2 J6.1
N$9
  Top 0.406: R25.1 LED1.1
N$11
  Top 0.406: R24.1 LED2.1
N$12
  Top 0.406: R23.1 LED3.1
N$13
  Top 0.406: LED4.1 R22.1
QSPI_CSN  (via drill 0.35)
  Top 0.152: IC1.56 30.22,10.53 29.84,10.16 29.21,9.53 29.21,5.4 28.26,4.45 26.67,4.45 26.05,5.07 IC7.1 | 26.05,6.16 25.54,6.67 23.26,6.67 R19.1 22.54,7.3 v13.14,7.3 | v7.62,10.48 6.52,10.48 R3.1
  Top 0.203: 26.05,6.16 IC7.1
  Bottom 0.152: v7.62,10.48 10.79,7.3 v13.14,7.3
QSPI_SCK
  Top 0.152: IC1.52 28.93,12.34 28.16,11.57 28.16,10.84 27.04,9.72 27.04,8.69 26.98,8.69 IC7.6
QSPI_SIO_0
  Top 0.152: IC1.53 29.27,11.94 29.26,11.89 29.21,11.91 28.54,11.23 28.54,10.76 27.55,9.77 27.55,9.13 27.55,9.01 27.58,8.99 27.58,8.69 IC7.5
QSPI_SIO_1
  Top 0.152: IC7.2 26.55,5.2 26.99,4.76 27.94,4.76 28.89,5.71 28.89,10.16 29.55,10.82 29.55,11.13 IC1.55
QSPI_SIO_2
  Top 0.152: IC1.54 29.44,11.54 28.92,11.01 28.92,10.71 28.57,10.36 28.57,5.94 27.71,5.08 27.3,5.08 27.05,5.34 IC7.3
QSPI_SIO_3
  Top 0.152: IC1.51 29.04,12.73 28.72,12.73 27.86,11.87 27.86,11.1 26.54,9.78 26.54,9.44 26.54,8.69 26.52,8.69 IC7.7
REMOTE
  Top 0.406: IC6.24 85.28,27.09 89.83,22.54 J1.2
RUN  (via drill 0.35)
  Top 0.152: IC1.26 37.68,15.13 38.62,16.08 38.62,19.16 v38.61,19.18 | v44.96,19.18 46.23,19.18 TP1.TP
  Top 0.305: S2.2 S2.1
  Top 0.406: C7.2 49.73,26.05 S2.2 | R6.1 43.68,22.45 IC8.1 45.78,21.42 46.35,21.42 | 46.35,21.42 S2.1 | TP1.TP 46.35,21.42
  Bottom 0.152: v38.61,19.18 v44.96,19.18
SCK  (via drill 0.35)
  Top 0.152: v11.43,4.45 JP1.2 | IC1.4 32.26,8.76 v32.07,8.57
  Bottom 0.152: JP1.2 v11.43,4.45 13.02,4.45 14.29,5.71 17.63,5.71 20.73,8.81 30.88,8.81 31.11,8.57 v32.07,8.57
SCL  (via drill 0.3, 0.35)
  Top 0.152: v32.58,11.24 33.59,11.24 34.26,10.58 IC1.9 34.26,7.2 35.42,6.03 v36.2,6.03 | R10.1 16.73,9.53 17.42,8.84 19.51,8.84 20.64,9.97 v20.64,10.73 20.64,12.38 v20.64,21.91 | v19.66,24.23 19.51,24.08 17.53,24.08 IC4.15
  Top 0.254: IC5.1 14.84,10.57 15.57,9.84 R10.1
  Bottom 0.152: v20.64,10.73 31.81,10.73 32.32,11.24 v32.58,11.24 | v20.64,21.91 19.66,22.89 v19.66,24.23 | v36.2,6.03 39.37,6.03 41.91,3.49 JP3.3
SCL1  (via drill 0.35)
  Top 0.152: 38.1,31.11 38.47,31.11 42.63,31.11 42.67,31.09 R11.1 | 38.1,31.11 37.99,31.11 J4.2 | IC4.14 19.8,23.61 22.54,26.35 v30.16,26.35 | v38.1,28.57 38.1,31.11
  Bottom 0.152: v30.16,26.35 33.02,26.35 35.24,28.57 v38.1,28.57
SCL2
  Top 0.152: J3.2 11.99,32.55 13.43,31.11 R9.1 15.46,30.15 17.38,28.24 IC4.16
SDA  (via drill 0.35)
  Top 0.152: JP3.2 39.37,4.45 38.64,5.17 35.53,5.17 34.14,6.56 33.85,6.85 IC1.8 33.85,10.4 33.66,10.6 32,10.6 31.5,11.11 v31.5,11.49 | IC4.12 17.53,22.55 19.2,22.55 19.66,22.1 19.66,13.98 18.75,13.07 18.75,13.02 | 18.75,13.02 14.73,13.02 | 18.75,13.02 18.73,13.01 v18.73,11.49
  Top 0.254: IC5.4 14.73,12.34 14.73,12.65 14.73,13.02 14.73,13.62 R13.1
  Bottom 0.152: v18.73,11.49 19.11,11.49 v31.5,11.49
SDA1  (via drill 0.35)
  Top 0.152: J4.3 36.01,31.65 35.48,31.11 32.38,31.11 v32.38,30.1 | IC4.13 20.55,23.11 23.16,25.72 v29.21,25.72 | R12.1 32.16,31.09 32.3,31.11
  Top 0.406: 32.3,31.11 32.38,31.11
  Bottom 0.152: v29.21,25.72 29.21,26.99 32.28,30.05 32.31,30.02 v32.38,30.1
SDA2  (via drill 0.35)
  Top 0.152: 8.58,31.11 10.01,32.55 J3.3 | R14.1 8.38,31.11 8.58,31.11 | IC4.11 18.85,22.11 v19.05,21.91 | v11.43,27.94 8.58,30.79 8.58,31.11
  Bottom 0.152: v19.05,21.91 19.05,22.54 18.34,23.26 18.34,25.31 15.71,27.94 v11.43,27.94
SWDCLK  (via drill 0.35)
  Top 0.152: IC1.24 36.59,14.34 v36.07,14.86
  Bottom 0.152: v36.07,14.86 36.7,14.86 36.96,14.61 37.34,14.22 37.34,12.83 33.77,9.26 33.77,5.87 32.93,5.03 28.15,5.03 26.67,3.56 JP2.1
SWDIO  (via drill 0.35)
  Top 0.152: IC1.25 37.97,14.73 v38.1,14.61 | JP2.3 v34.29,5.08
  Bottom 0.152: v38.1,14.61 38.1,12.95 34.29,9.14 v34.29,5.08
USB_D+  (via drill 0.3, 0.35)
  Top 0.152: J9.3 8.78,21.59 D2.1 9.32,21.48 v9.84,20.95 | v23.47,13.97 R8.1
  Bottom 0.152: v9.84,20.95 11.11,20.95 16.83,15.24 18.1,15.24 19.37,13.97 23.43,13.97 v23.47,13.97
USB_D-  (via drill 0.3, 0.35)
  Top 0.152: J9.2 7.53,22.24 8.26,22.97 D3.1 9,22.86 v9.84,22.86 | R2.1 23.48,14.92 v23.47,14.92
  Bottom 0.152: v9.84,22.86 10.48,22.86 17.14,16.19 18.41,16.19 19.68,14.92 23.43,14.92 23.46,14.92 v23.47,14.92
USB_DM
  Top 0.152: IC1.46 27.27,14.73 R2.2
USB_DP
  Top 0.152: IC1.47 27.45,14.34 R8.2
VBUS
  Top 0.152: D4.1 8.84,25.45 8.78,25.4
  Top 0.406: J9.1 7.04,22.89 7.92,23.76 7.92,25.4 | 6.24,29.09 5.59,29.74 3.2,29.74 3.2,30.25 3.17,30.25 D1.2 | 6.24,29.09 7.92,27.41 7.92,25.4 | 8.78,25.4 7.92,25.4 | JP7.1 6.24,29.09
XIN
  Top 0.152: IC1.20 41.24,12.73
  Top 0.203: 41.24,12.73 42.11,11.87 Y1.1 44.97,11.87 46.35,10.48 C5.1
XOUT
  Top 0.152: IC1.21 40.1,13.13 R1.2
XOUTI
  Top 0.203: R1.1 41.11,15.24 44.96,15.24 46.03,14.17 Y1.3 46.98,14.49 C6.1

## Text on the board
tPlace: FAN | FAN | +24V | +3V3 | SDA | SCL | GND | A0 | +3V3 | GND | LED | +3V3 | SDA | SCL | GND | GND | LED | GND | LED4 | GND | VBUS | LED3 | LMP | USER | GND | +5V | LED2 | RESET | RMT | LED1 | +24V | +24V | BOOTSEL | GND | 3.3V | +3V3 | SCK | MOSI | MISO | CS | GND | +3V3 | SCL | SDA | GND | +3V3 | A1 | GND | +3V3 | A2 | A3 | GND | EXT2 | EXT1 | +24V